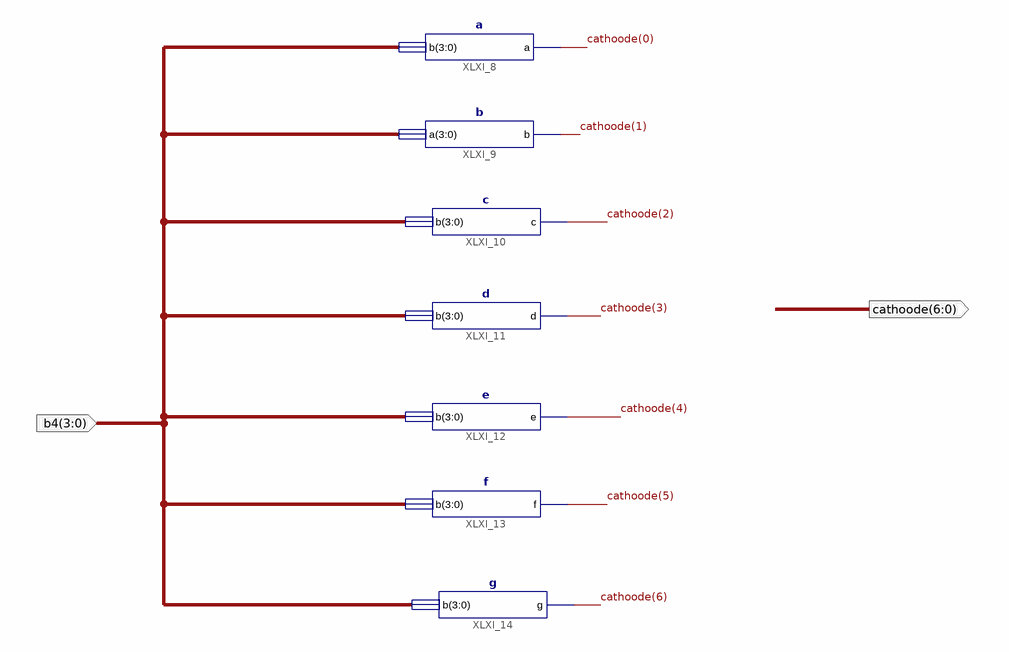
[diagram p0: schematic sheet 1]
// Xilinx ISE schematic binaryto7segment.sch (artix7) as structural Verilog: 7 symbols, 2 ports
module binaryto7segment (
  input  [3:0] b4,
  output [6:0] cathoode
);

  a XLXI_8 (.a(cathoode[0]), .b(b4));
  b XLXI_9 (.a(b4), .b(cathoode[1]));
  c XLXI_10 (.b(b4), .c(cathoode[2]));
  d XLXI_11 (.b(b4), .d(cathoode[3]));
  e XLXI_12 (.b(b4), .e(cathoode[4]));
  f XLXI_13 (.b(b4), .f(cathoode[5]));
  g XLXI_14 (.b(b4), .g(cathoode[6]));
endmodule
